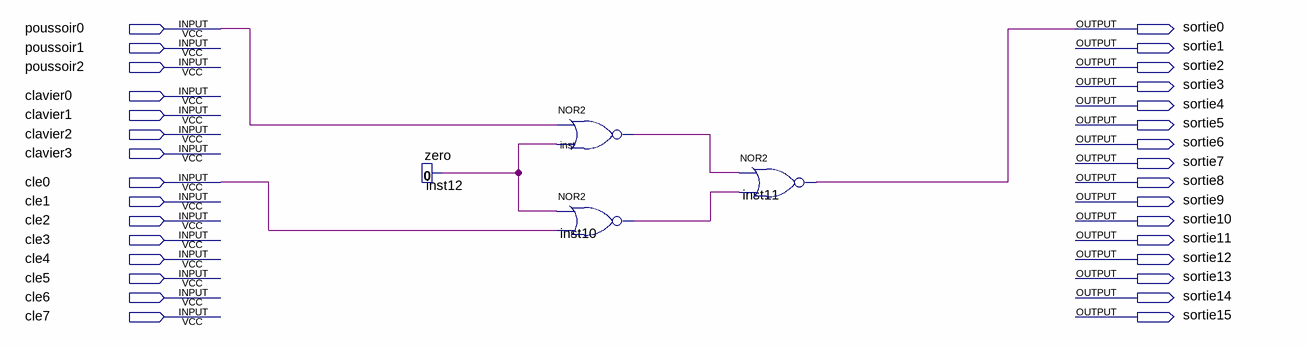
[diagram p0: schematic sheet]
// Quartus schematic fpga1.bdf as structural Verilog: 4 symbols, 31 pins
module fpga1 (
  input  poussoir0,
  input  poussoir1,
  input  poussoir2,
  input  clavier0,
  input  clavier1,
  input  clavier2,
  input  clavier3,
  input  cle0,
  input  cle1,
  input  cle2,
  input  cle3,
  input  cle4,
  input  cle5,
  input  cle6,
  input  cle7,
  output sortie0,
  output sortie1,
  output sortie2,
  output sortie3,
  output sortie4,
  output sortie5,
  output sortie6,
  output sortie7,
  output sortie8,
  output sortie9,
  output sortie10,
  output sortie11,
  output sortie12,
  output sortie13,
  output sortie14,
  output sortie15
);

  wire inst10_out, inst12_0, inst_out;

  zero inst12 (.\0 (inst12_0));
  nor inst (inst_out, poussoir0, inst12_0);
  nor inst10 (inst10_out, inst12_0, cle0);
  nor inst11 (sortie0, inst_out, inst10_out);
endmodule
